# EAGLE design Schematic_V0.0 (EAGLE 9.2.2)
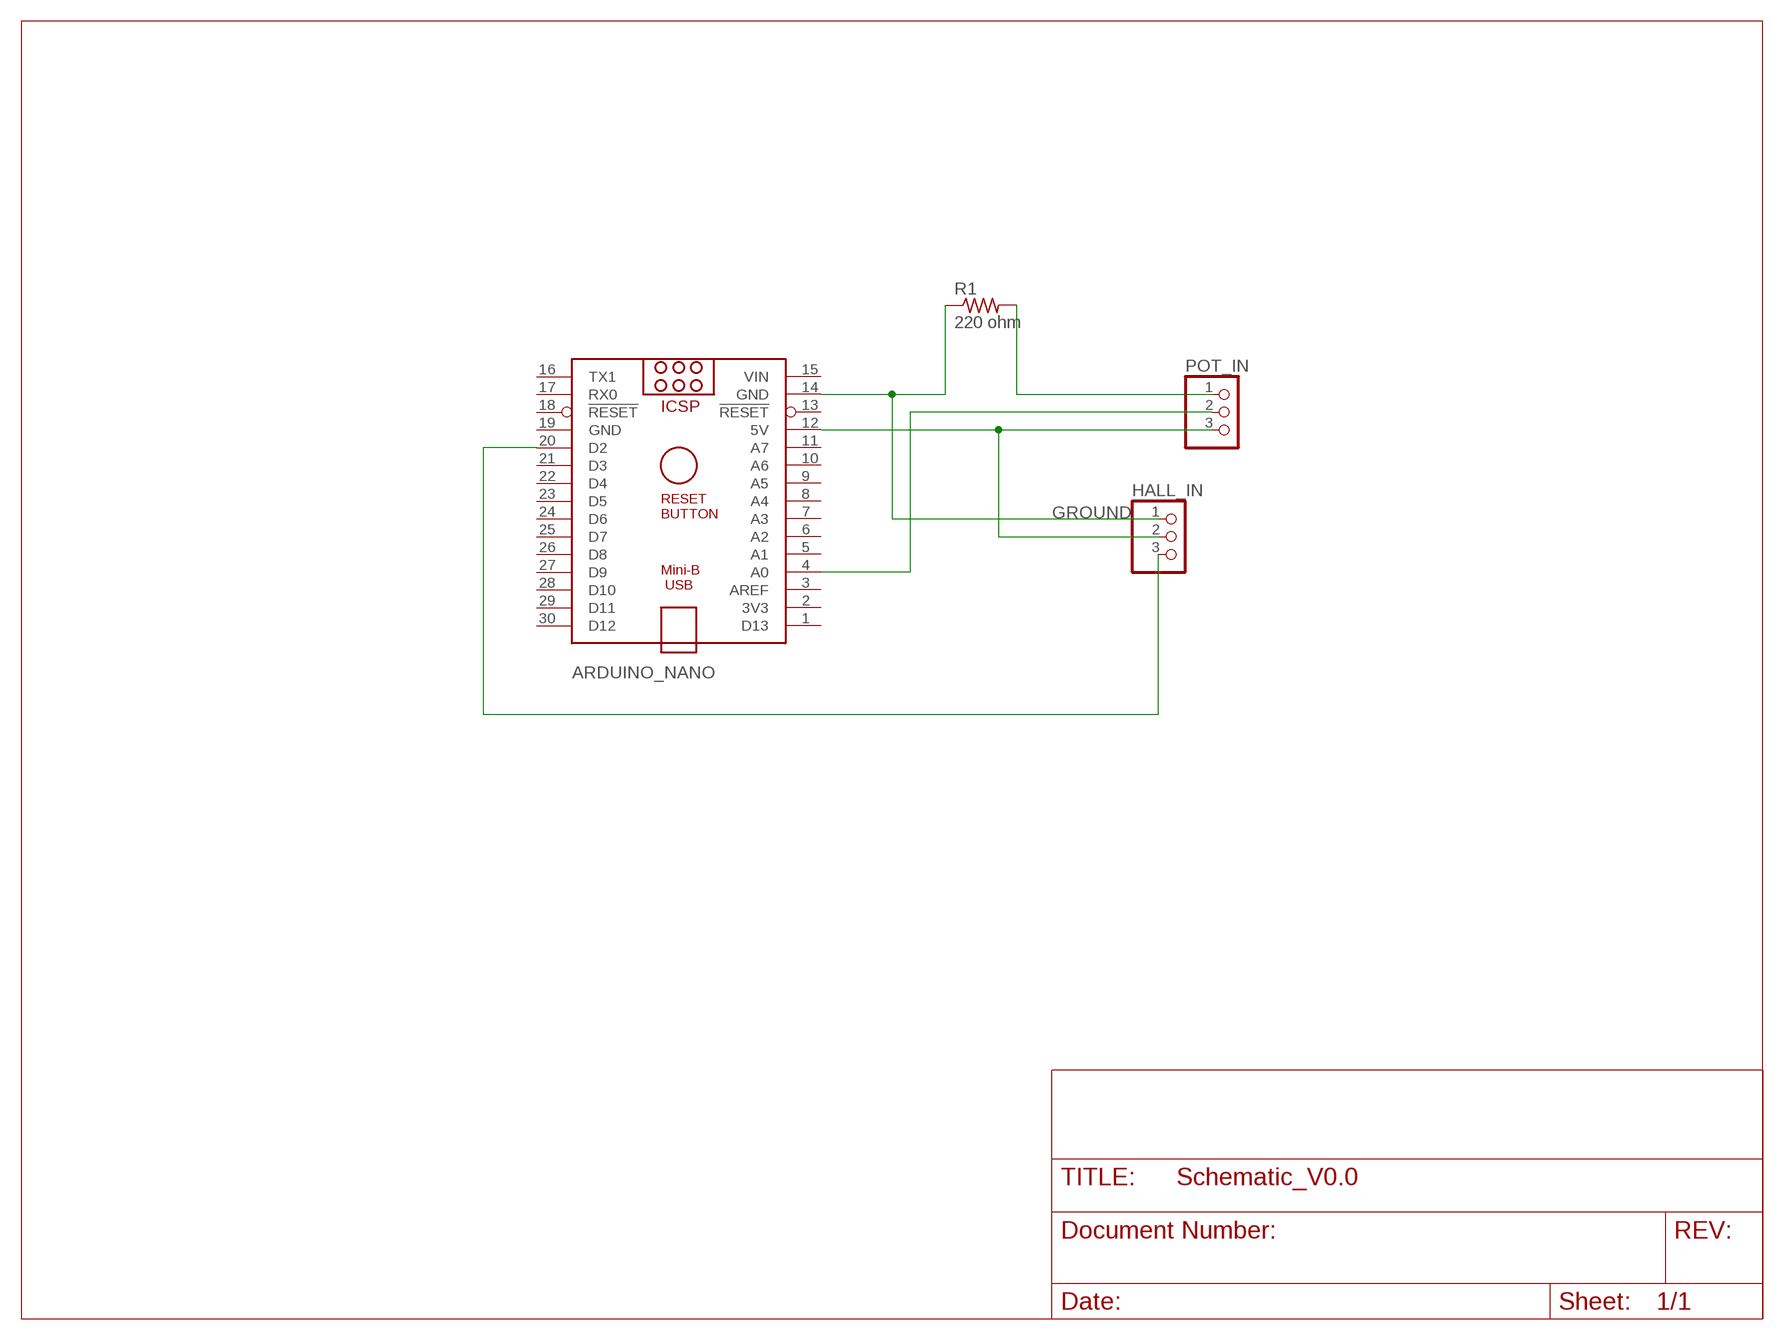
[diagram p0: schematic, sheet 1]

## Parts
ARDUINO_NANO  ARDUINO_NANO  [ARDUINO_NANO]
HALL_IN  PINHD-1X3  [1X03]
POT_IN  PINHD-1X3  [1X03]
R1  220 ohm  R-US_0204/7  [0204/7]

## Nets
GROUND: ARDUINO_NANO.14(GND) HALL_IN.1 R1.1
N$2: ARDUINO_NANO.12(5V) HALL_IN.2 POT_IN.3
N$3: POT_IN.1 R1.2
N$4: ARDUINO_NANO.4(A0) POT_IN.2
N$5: ARDUINO_NANO.20(D2) HALL_IN.3
Unconnected: ARDUINO_NANO.1(D13) ARDUINO_NANO.2(3V3) ARDUINO_NANO.3(AREF) ARDUINO_NANO.5(A1) ARDUINO_NANO.6(A2) ARDUINO_NANO.7(A3) ARDUINO_NANO.8(A4) ARDUINO_NANO.9(A5) ARDUINO_NANO.10(A6) ARDUINO_NANO.11(A7) ARDUINO_NANO.13(!RESET) ARDUINO_NANO.16(TX1) ARDUINO_NANO.17(RX0) ARDUINO_NANO.18(!RESET) ARDUINO_NANO.21(D3) ARDUINO_NANO.22(D4) ARDUINO_NANO.23(D5) ARDUINO_NANO.24(D6) ARDUINO_NANO.25(D7) ARDUINO_NANO.26(D8) ARDUINO_NANO.27(D9) ARDUINO_NANO.28(D10) ARDUINO_NANO.29(D11) ARDUINO_NANO.30(D12)

## Power pins joined to a net without a drawn wire
GROUND: ARDUINO_NANO.19(GND)
VIN: ARDUINO_NANO.15(VIN)

## Library data of the parts
ARDUINO_NANO = ArduinoNanoV30:ARDUINO_NANO: Arduino Nano V3.0 Overview: The Arduino Nano is a small, complete, and breadboard-friendly board based on the ATmega328 (Arduino Nano 3.x) or ATmega168 (Arduino Nano 2.x). It has more or less the same functionality of the Arduino Duemilanove, but in a different package. It lacks only a DC power jack, and works with a Mini-B USB cable instead of a standard one. The Nano was designed and is being produced by Gravitech. Specifications: Microcontroller Atmel ATmega168 or ATmega328 Operating Voltage (logic level) 5 V Input Voltage (recommended) 7-12 V Input Voltage (limits) 6-20 V Digital I/O Pins 14 (of which 6 provide PWM output) Analog Input Pins 8 DC Current per I/O Pin 40 mA Flash Memory 16 KB (ATmega168) or 32 KB (ATmega328) of which 2 KB used by bootloader SRAM 1 KB (ATmega168) or 2 KB (ATmega328) EEPROM 512 bytes (ATmega168) or 1 KB (ATmega328) Clock Speed 16 MHz Dimensions 0.73" x 1.70" Length 45 mm Width 18 mm Weigth 5 g Power: The Arduino Nano can be powered via the Mini-B USB connection, 6-20V unregulated external power supply (pin 30), or 5V regulated external power supply (pin 27). The power source is automatically selected to the highest voltage source. Memory: The ATmega168 has 16 KB of flash memory for storing code (of which 2 KB is used for the bootloader); the ATmega328 has 32 KB, (also with 2 KB used for the bootloader). The ATmega168 has 1 KB of SRAM and 512 bytes of EEPROM (which can be read and written with the EEPROM library); the ATmega328 has 2 KB of SRAM and 1 KB of EEPROM. Input and Output: Each of the 14 digital pins on the Nano can be used as an input or output, using pinMode(), digitalWrite(), and digitalRead() functions. They operate at 5 volts. Each pin can provide or receive a maximum of 40 mA and has an internal pull-up resistor (disconnected by default) of 20-50 kOhms. In addition, some pins have specialized functions. Visit Arduino - ArduinoBoardNano <https://www.arduino.cc/en/Main/ArduinoBoardNano>
HALL_IN POT_IN = adafruit:PINHD-1X3: PIN HEADER
R1 = adafruit:R-US_: RESISTOR, American symbol

## Board
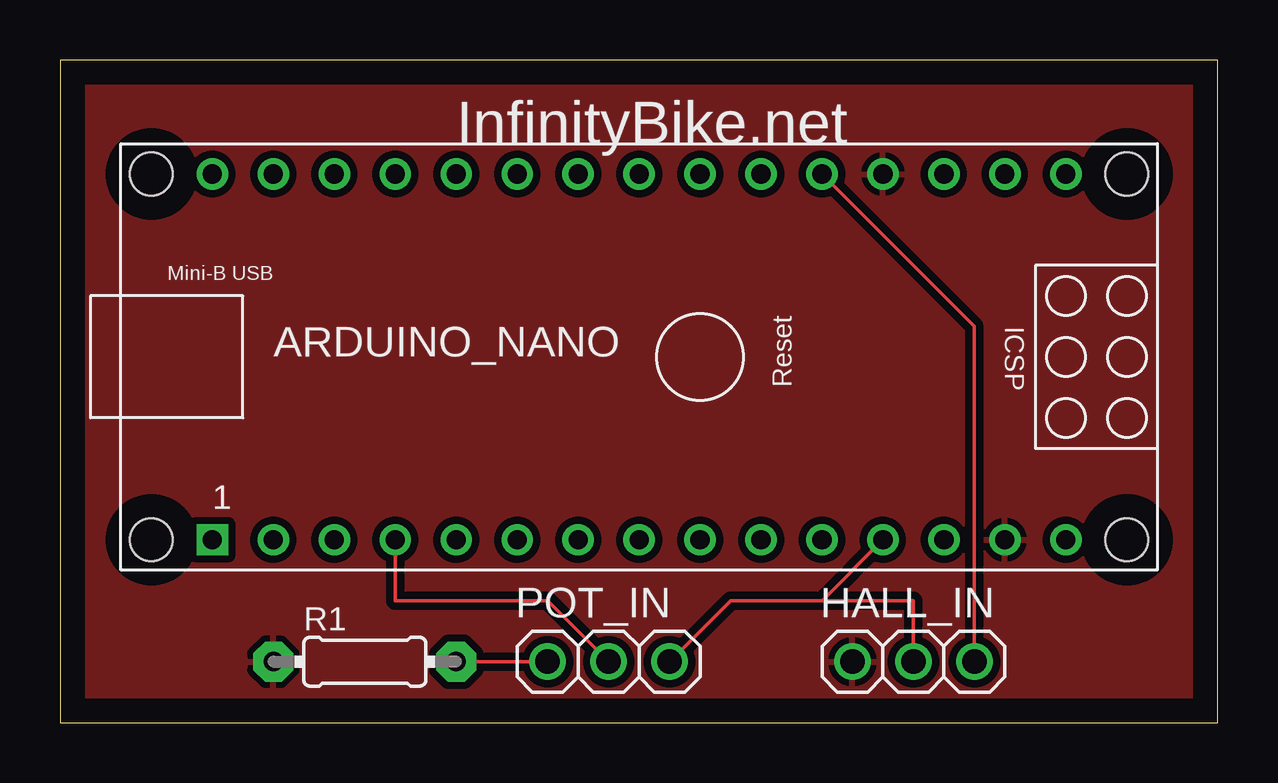
[diagram p1: board, top side]

Size 48.24 x 27.61 mm. Coordinates in mm from the lower left corner, seen from the top.
Outline: 0,0 48.24,0 48.24,27.61 0,27.61 0,0
Copper layers (1*16): Top 0.035mm / dielectric 1.5mm / Bottom 0.035mm
Design rules "default": minimum track width 6mil, minimum drill 0.35mm, track to track 6mil, track to pad 6mil, pad to pad 6mil, via to via 6mil, smd to smd 6mil, copper to edge 40mil, drill to drill 6mil, minimum pad ring 10mil, minimum via ring 8mil, stop-mask expansion 4mil, vias tented up to drill 0mil, thermal gap 10mil

### Footprints (pad centres in the part's own frame; a part is rotated, then mirrored left to right if it is on the bottom)
ARDUINO_NANO = drill 0.8 square: 1 -20.32,-7.62 | drill 0.8: 2 -17.78,-7.62; 3 -15.24,-7.62; 4 -12.7,-7.62; 5 -10.16,-7.62; 6 -7.62,-7.62; 7 -5.08,-7.62; 8 -2.54,-7.62; 9 0,-7.62; 10 2.54,-7.62; 11 5.08,-7.62; 12 7.62,-7.62; 13 10.16,-7.62; 14 12.7,-7.62; 15 15.24,-7.62; 16 15.24,7.62; 17 12.7,7.62; 18 10.16,7.62; 19 7.62,7.62; 20 5.08,7.62; 21 2.54,7.62; 22 0,7.62; 23 -2.54,7.62; 24 -5.08,7.62; 25 -7.62,7.62; 26 -10.16,7.62; 27 -12.7,7.62; 28 -15.24,7.62; 29 -17.78,7.62; 30 -20.32,7.62 | hole 1.778: -22.86,-7.62; -22.86,7.62; 17.78,7.62; 17.78,-7.62
1X03 = drill 1.016: 1 -2.54,0; 2 0,0; 3 2.54,0
0204/7 = drill 0.813 pad 1.676 octagon: 1 -3.81,0; 2 3.81,0

### Placement (x,y rotation side)
ARDUINO_NANO  26.67,15.24 0 top
HALL_IN  35.56,2.54 0 top
POT_IN  22.86,2.54 0 top
R1  12.7,2.54 0 top

### Tracks (layer width: path | path; a pad name or v marks a point on that pad's centre or on a via)
GROUND
  pour Top (isolate 0.305): 0,27.94 48.26,27.94 48.26,0 0,0
N$2
  Top 0.152: ARDUINO_NANO.12 31.75,5.08 | 31.75,5.08 35.56,5.08 HALL_IN.2 | 31.75,5.08 27.94,5.08 POT_IN.3
N$3
  Top 0.152: POT_IN.1 R1.2
N$4
  Top 0.152: POT_IN.2 20.32,5.08 13.97,5.08 ARDUINO_NANO.4
N$5
  Top 0.152: ARDUINO_NANO.20 38.1,16.51 HALL_IN.3

### Text on the board
tPlace: InfinityBike.net